# EAGLE design DCO core 1.0 (EAGLE 6.5.0)
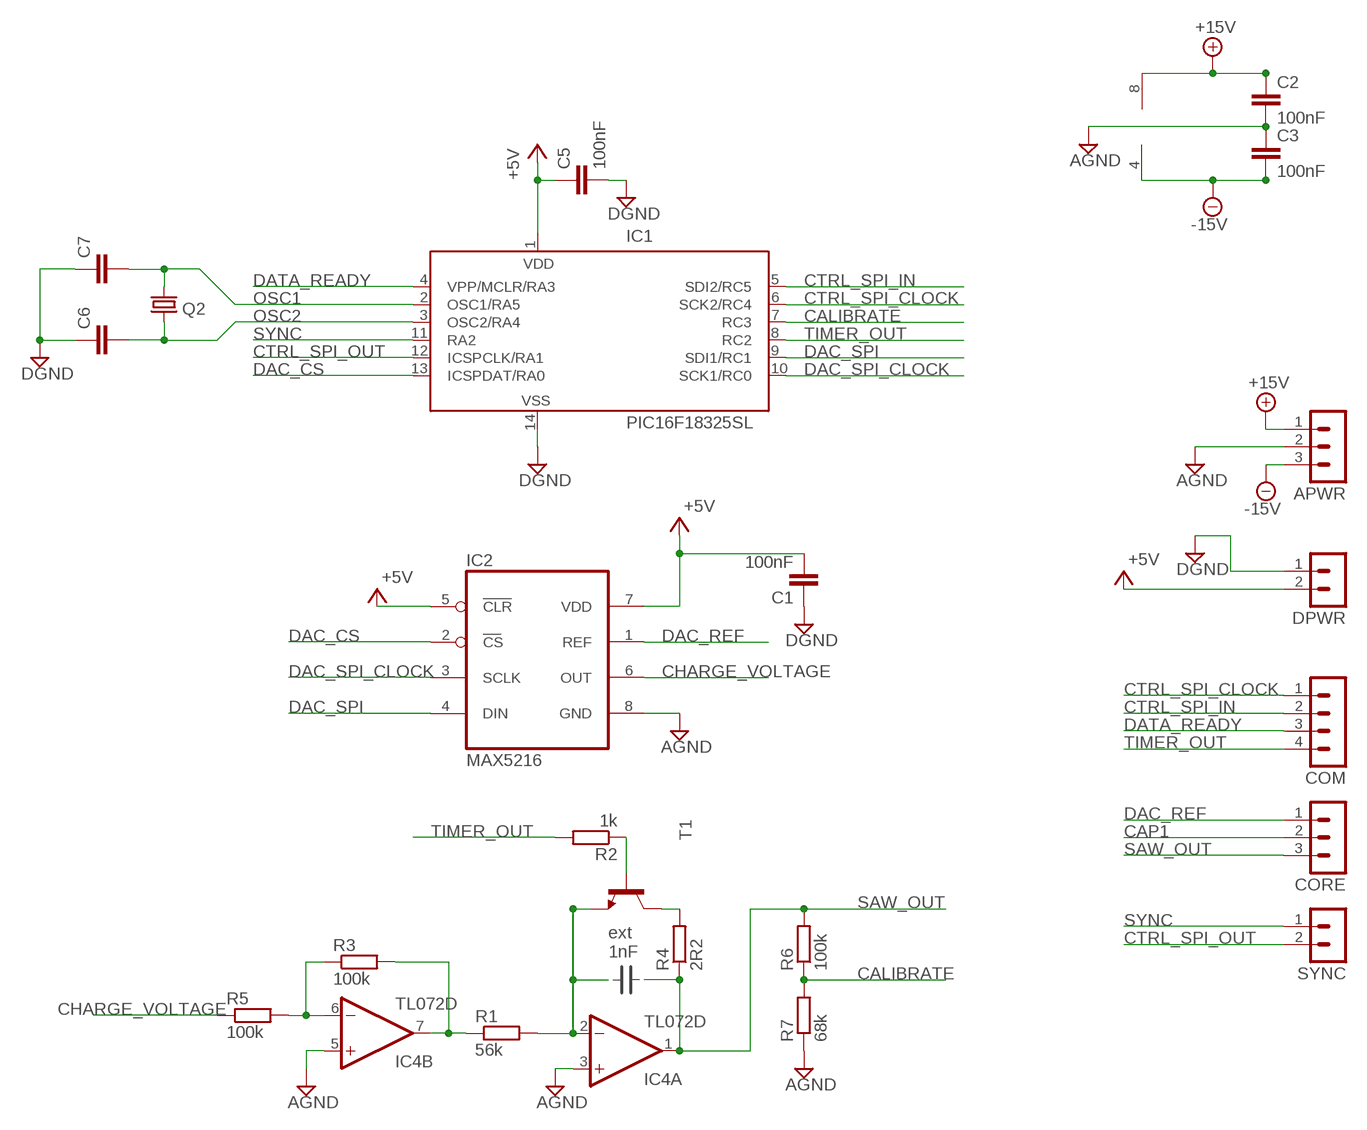
[diagram p0: schematic, sheet 1]

## Parts
APWR  MA03-1JP  [SIP-PIN03-1J]
C1  100nF  C-EUC0805  [C0805]
C2  100nF  C-EUC0805  [C0805]
C3  100nF  C-EUC0805  [C0805]
C5  100nF  C-EUC0805  [C0805]
C6  C-EUC0805  [C0805]
C7  C-EUC0805  [C0805]
COM  MA04-1JP  [SIP-PIN04-1J]
CORE  MA03-1JP  [SIP-PIN03-1J]
DPWR  MA02-1JP  [SIP-PIN02-1J]
IC1  PIC16F18325SL  [SO14J]
IC2  MAX5216  [UMAX8J]
IC4  TL072D  [SO08J]
Q2  CRYSTALHC49S  [HC49/S]
R1  56k  R-EU_R0805  [R0805]
R2  1k  R-EU_R0805  [R0805]
R3  100k  R-EU_R0805  [R0805]
R4  2R2  R-EU_R0805  [R0805]
R5  100k  R-EU_R0805  [R0805]
R6  100k  R-EU_R0805  [R0805]
R7  68k  R-EU_R0805  [R0805]
SYNC  MA02-1JP  [SIP-PIN02-1J]
T1  MMBT3904LT1-NPN-SOT23-BEC  [SOT23-BEC]

## Nets
+5V: C1.2 C5.1 DPWR.2 IC1.1(VDD) IC2.5(CLR) IC2.7(VDD)
+15V: APWR.1 C2.1 IC4.8(P:V+)
-15V: APWR.3 C3.2 IC4.4(P:V-)
AGND: APWR.2 C2.2 C3.1 IC2.8(GND) IC4.3(A:+IN) IC4.5(B:+IN) R7.1
CALIBRATE: IC1.7(RC3) R6.1 R7.2
CAP1: CORE.2 IC4.2(A:-IN) R1.2 T1.E
CHARGE_VOLTAGE: IC2.6(OUT) R5.1
CTRL_SPI_CLOCK: COM.1 IC1.6(SCK2/RC4)
CTRL_SPI_IN: COM.2 IC1.5(SDI2/RC5)
CTRL_SPI_OUT: IC1.12(ICSPCLK/RA1) SYNC.2
DAC_CS: IC1.13(ICSPDAT/RA0) IC2.2(CS)
DAC_REF: CORE.1 IC2.1(REF)
DAC_SPI: IC1.9(SDI1/RC1) IC2.4(DIN)
DAC_SPI_CLOCK: IC1.10(SCK1/RC0) IC2.3(SCLK)
DATA_READY: COM.3 IC1.4(VPP/MCLR/RA3)
DGND: C1.1 C5.2 C6.1 C7.1 DPWR.1 IC1.14(VSS)
N$1: R4.2 T1.C
N$2: R2.1 T1.B
N$4: IC4.6(B:-IN) R3.1 R5.2
N$10: IC4.7(B:OUT) R1.1 R3.2
OSC1: C7.2 IC1.2(OSC1/RA5) Q2.2
OSC2: C6.2 IC1.3(OSC2/RA4) Q2.1
SAW_OUT: CORE.3 IC4.1(A:OUT) R4.1 R6.2
SYNC: IC1.11(RA2) SYNC.1
TIMER_OUT: COM.4 IC1.8(RC2) R2.2

## Notes on the sheet
- ext
  1nF

## Library data of the parts
APWR CORE = joakim:MA03-1J: PIN HEADER
C1-C3 C5-C7 = resistor:C-EU: CAPACITOR, European symbol
COM = joakim:MA04-1J: PIN HEADER
DPWR SYNC = joakim:MA02-1J
IC1 = joakim:PIC16F18325: 14-Pin, Flash-Based 8-Bit CMOS Microcontroller; MF: MICROCHIP; MPN: PIC16F676-I/SL; OC_FARNELL: 9760520; OC_NEWARK: 92C4557
IC2 = joakim:MAX5216: DIGITAL/ANALOG CONVERTER Covers MAX5214 (14 bit), MAX5216 (16 bit)
IC4 = joakim:TL072: OP AMP
Q2 = crystal:CRYSTAL: CRYSTAL; OC_FARNELL: 1667008; OC_NEWARK: unknown
R1-R7 = resistor:R-EU_: RESISTOR, European symbol
T1 = transistor:*-NPN-: NPN Transistror BF959 corrected 2008.03.06

## Board
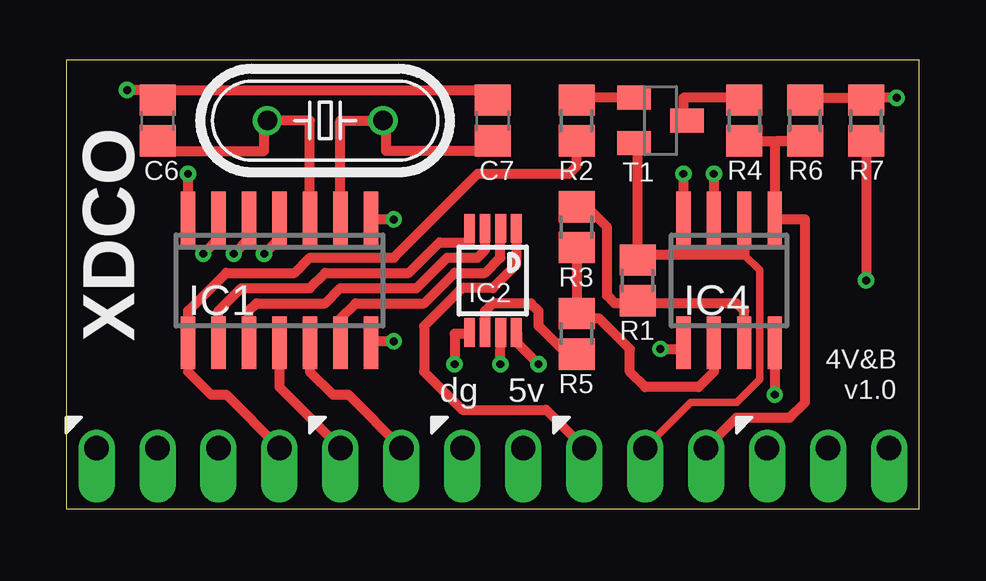
[diagram p1: board, top side]
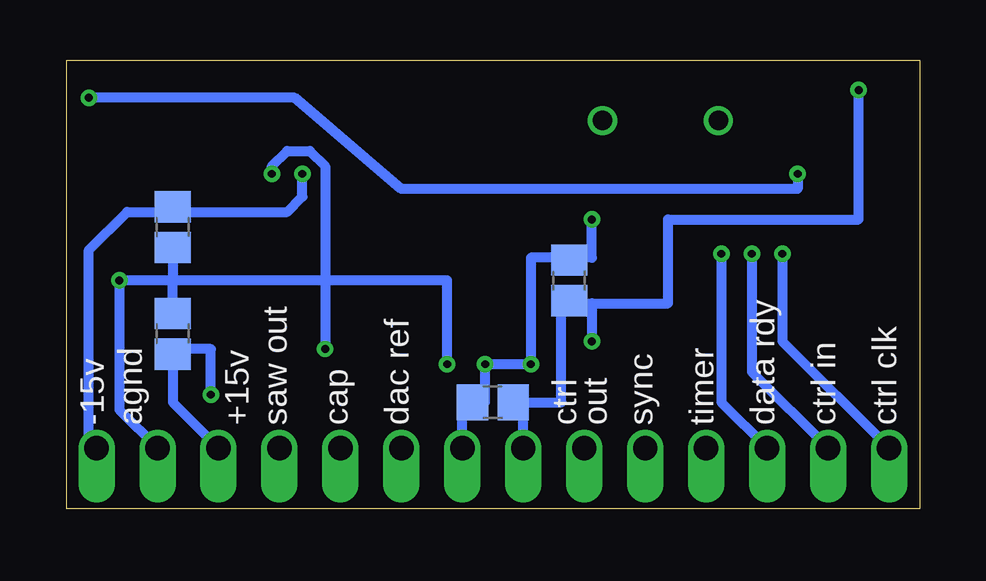
[diagram p2: board, bottom side, seen from below]

Size 35.54 x 18.72 mm. Coordinates in mm from the lower left corner, seen from the top.
Outline: 0,0 35.54,0 35.54,18.72 0,18.72 0,0
Copper layers (1*16): Top 0.0356mm / dielectric 1.5011mm / Bottom 0.0356mm
Design rules "oshpark-2layer": minimum track width 6mil, minimum drill 13mil, track to track 6mil, track to pad 6mil, pad to pad 6mil, via to via 6mil, smd to smd 6mil, copper to edge 15mil, drill to drill 6mil, minimum pad ring 7mil, minimum via ring 7mil, stop-mask expansion 2.5mil, vias tented up to drill 0mil, thermal gap 10mil

### Footprints (pad centres in the part's own frame; a part is rotated, then mirrored left to right if it is on the bottom)
SIP-PIN03-1J = drill 1.016 offset: 1 -2.54,0; 2 0,0; 3 2.54,0
C0805 = smd 1.3 x 1.5: 1 -0.85,0; 2 0.85,0
SIP-PIN04-1J = drill 1.016 offset: 1 -3.81,0; 2 -1.27,0; 3 1.27,0; 4 3.81,0
SIP-PIN02-1J = drill 1.016 offset: 1 -1.27,0; 2 1.27,0
SO14J = smd 0.6 x 2.2: 1 -3.81,-2.6; 2 -2.54,-2.6; 3 -1.27,-2.6; 4 0,-2.6; 5 1.27,-2.6; 6 2.54,-2.6; 7 3.81,-2.6; 8 3.81,2.6; 9 2.54,2.6; 10 1.27,2.6; 11 0,2.6; 12 -1.27,2.6; 13 -2.54,2.6; 14 -3.81,2.6
UMAX8J = smd 0.45 x 1.2: 1 -0.975,-2.175; 2 -0.325,-2.175; 3 0.325,-2.175; 4 0.975,-2.175; 5 0.975,2.175; 6 0.325,2.175; 7 -0.325,2.175; 8 -0.975,2.175
SO08J = smd 0.6 x 2.2: 1 -1.905,-2.6; 2 -0.635,-2.6; 3 0.635,-2.6; 4 1.905,-2.6; 5 1.905,2.6; 6 0.635,2.6; 7 -0.635,2.6; 8 -1.905,2.6
HC49/S = drill 0.813: 1 -2.413,0; 2 2.413,0
R0805 = smd 1.3 x 1.5: 1 -0.85,0; 2 0.85,0
SOT23-BEC = smd 1 x 1.4: B -0.95,-1.1; C 0,1.1; E 0.95,-1.1

### Placement (x,y rotation side)
APWR  31.75,2.54 0 top
C1  17.78,4.45 180 bottom
C2  31.11,7.3 90 bottom
C3  31.11,11.75 90 bottom
C5  14.61,9.53 270 bottom
C6  3.81,16.19 270 top
C7  17.78,16.19 270 top
COM  5.08,2.54 0 top
CORE  24.13,2.54 0 top
DPWR  17.78,2.54 0 top
IC1  8.89,9.53 180 top
IC2  17.78,9.53 180 top
IC4  27.62,9.53 180 top
Q2  10.79,16.19 0 top
R1  23.81,9.53 90 top
R2  21.27,16.19 270 top
R3  21.27,11.75 90 top
R4  28.26,16.19 90 top
R5  21.27,7.3 90 top
R6  30.8,16.19 270 top
R7  33.34,16.19 90 top
SYNC  12.7,2.54 0 top
T1  24.77,16.19 270 top

### Tracks (layer width: path | path; a pad name or v marks a point on that pad's centre or on a via)
+5V  (via drill 0.33)
  Top 0.406: 12.7,11.43 IC1.1 12.76,12.06 v13.65,12.06 | v18.1,6.03 IC2.7 | IC2.5 16.8,7.33 16.83,7.3 16.19,7.3 v16.19,6.03
  Bottom 0.406: v13.65,12.06 13.65,10.48 14.5,10.48 C5.1 14.61,10.48 16.19,10.48 v16.19,6.03 v18.1,6.03 18.1,4.45 C1.2 19.05,4.03 DPWR.2
+15V  (via drill 0.33)
  Top 0.406: IC4.8 v29.53,4.76
  Bottom 0.406: v29.53,4.76 29.53,6.67 30.9,6.67 C2.1 31.11,4.45 APWR.1
-15V  (via drill 0.33)
  Top 0.406: v25.72,13.97 IC4.4
  Bottom 0.406: APWR.3 34.61,2.86 34.61,10.79 33.02,12.38 31.33,12.38 C3.2 31.11,12.38 26.35,12.38 25.72,13.02 v25.72,13.97
AGND  (via drill 0.33)
  Top 0.406: IC2.8 18.8,7.3 18.8,6.92 v19.68,6.03 | v26.99,13.97 IC4.3 | v24.77,6.67 25.72,6.67 IC4.5 | R7.1 v33.34,9.53
  Bottom 0.406: v19.68,6.03 19.68,9.53 24.77,9.53 | 24.77,9.53 31.11,9.53 | 31.11,9.53 v33.34,9.53 33.34,4.13 APWR.2 | 24.77,9.53 v24.77,6.67 | C3.1 31.11,9.53 | C2.2 31.11,9.53 | v26.99,13.97 26.99,14.29 26.35,14.92 25.4,14.92 24.77,14.29 24.77,9.53
CALIBRATE  (via drill 0.33)
  Top 0.406: IC1.7 v5.08,13.97 | v34.61,17.14 33.23,17.14 | 32.8,17.14 R7.2 33.23,17.14 | R6.1 30.8,17.14 32.8,17.14 | 32.8,17.14 33.23,17.14
  Bottom 0.406: v5.08,13.97 5.08,13.34 21.59,13.34 26.04,17.14 v34.61,17.14
CAP1
  Top 0.305: 28.26,10.59 28.89,9.96 28.89,5.4 27.94,4.45 26.04,4.45 CORE.2
  Top 0.406: T1.E 23.81,15.1 R1.2 24.03,10.59 28.26,10.59 IC4.2
CHARGE_VOLTAGE
  Top 0.406: R5.1 20.85,6.45 19.68,7.62 19.68,8.26 19.37,8.57 17.78,8.57 17.46,8.26 IC2.6
CTRL_SPI_CLOCK  (via drill 0.33)
  Top 0.406: IC1.6 6.35,11.27 v5.71,10.64
  Bottom 0.406: v5.71,10.64 5.71,6.99 COM.1
CTRL_SPI_IN  (via drill 0.33)
  Top 0.406: IC1.5 7.62,11.27 v6.99,10.64
  Bottom 0.406: v6.99,10.64 6.99,5.71 COM.2
CTRL_SPI_OUT
  Top 0.406: IC1.12 10.16,5.71 11.11,4.76 11.75,4.76 SYNC.2
DAC_CS
  Top 0.406: IC1.13 11.43,7.94 12.06,8.57 14.92,8.57 16.19,9.84 17.46,9.84 18.1,10.48 18.1,11.69 IC2.2
DAC_REF
  Top 0.406: IC2.1 18.75,10.18 17.78,9.21 16.51,9.21 14.92,7.62 14.92,5.71 16.51,4.13 20,4.13 CORE.1
DAC_SPI
  Top 0.406: IC1.9 6.35,8.26 7.3,9.21 10.16,9.21 10.79,9.84 14.29,9.84 15.56,11.11 16.83,11.11 16.83,11.68 IC2.4
DAC_SPI_CLOCK
  Top 0.406: IC1.10 7.62,8.26 7.94,8.57 10.79,8.57 11.43,9.21 14.61,9.21 15.88,10.48 17.14,10.48 17.46,10.79 IC2.3
DATA_READY  (via drill 0.33)
  Top 0.406: IC1.4 8.89,11.27 v8.26,10.64
  Bottom 0.406: v8.26,10.64 8.26,4.45 COM.3
DGND  (via drill 0.33)
  Top 0.406: 4.13,17.46 17.68,17.46 C7.1 | v13.65,6.99 12.76,6.99 IC1.14 | C6.1 4.13,17.46 | 4.13,17.46 v2.54,17.46
  Bottom 0.406: 13.65,8.57 14.61,8.57 C5.2 14.92,8.36 14.92,4.45 C1.1 16.51,4.03 DPWR.1 | 13.65,8.57 v13.65,6.99 | 13.65,8.57 10.48,8.57 10.48,12.06 2.54,12.06 v2.54,17.46
N$1
  Top 0.406: R4.2 28.16,17.14 25.72,17.14 25.72,16.19 T1.C
N$2
  Top 0.406: T1.B 21.37,17.14 R2.1
N$4
  Top 0.406: R3.1 R5.2 21.49,7.94 22.23,7.94 23.5,6.67 23.5,5.71 24.13,5.08 26.35,5.08 26.99,5.71 IC4.6
N$10
  Top 0.406: R3.2 21.69,12.6 22.54,11.75 22.54,8.89 22.86,8.57 23.81,8.57 R1.1 23.91,8.57 27.94,8.57 28.26,8.26 IC4.7
OSC1
  Top 0.406: IC1.2 11.43,16.19 Q2.2 13.34,16.19 13.34,14.92 17.46,14.92 C7.2
OSC2
  Top 0.406: IC1.3 10.16,16.19 Q2.1 8.26,16.19 8.26,14.92 4.13,14.92 C6.2
SAW_OUT
  Top 0.406: R4.1 R6.2 29.63,15.34 29.53,15.24 IC4.1 29.59,12.06 30.8,12.06 30.8,4.45 30.16,3.81 27.94,3.81 CORE.3
SYNC
  Top 0.406: IC1.11 8.89,5.08 SYNC.1
TIMER_OUT
  Top 0.406: COM.4 6.67,4.76 6.03,4.76 5.08,5.71 IC1.8 5.08,8.26 6.67,9.84 9.53,9.84 10.16,10.48 13.65,10.48 17.14,13.97 20.95,13.97 21.27,14.29 R2.2

### Text on the board
tNames: XDCO | 4V&B | v1.0 | dg | 5v
bNames: ctrl clk | ctrl in | data rdy | timer | sync | out | ctrl | dac ref | cap | saw out | +15v | agnd | -15v